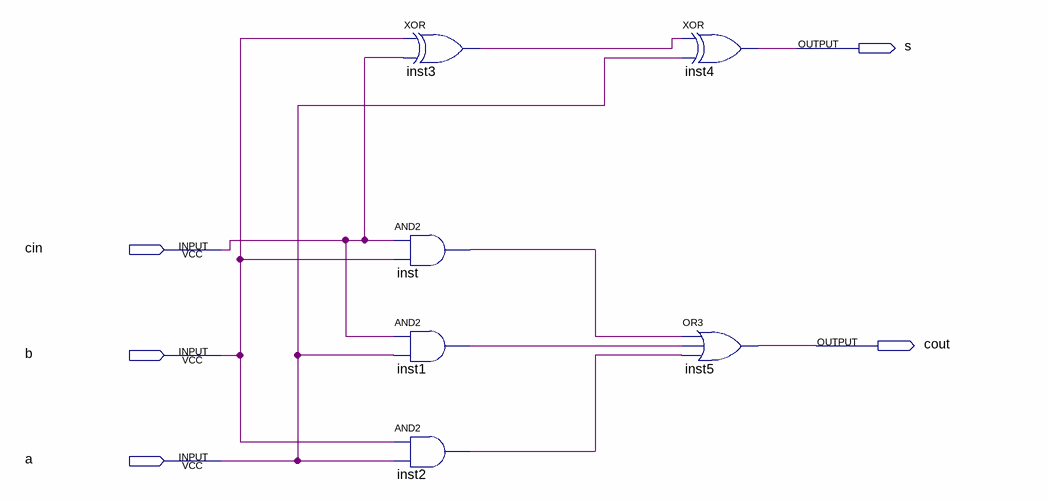
[diagram p0: schematic sheet]
// Quartus schematic adder.bdf as structural Verilog: 6 symbols, 5 pins
module adder (
  input  cin,
  input  b,
  input  a,
  output s,
  output cout
);

  wire inst1_out, inst2_out, inst3_out, inst_out;

  xor inst3 (inst3_out, b, cin);
  and inst (inst_out, cin, b);
  and inst1 (inst1_out, cin, a);
  and inst2 (inst2_out, b, a);
  xor inst4 (s, inst3_out, a);
  or inst5 (cout, inst_out, inst1_out, inst2_out);
endmodule
